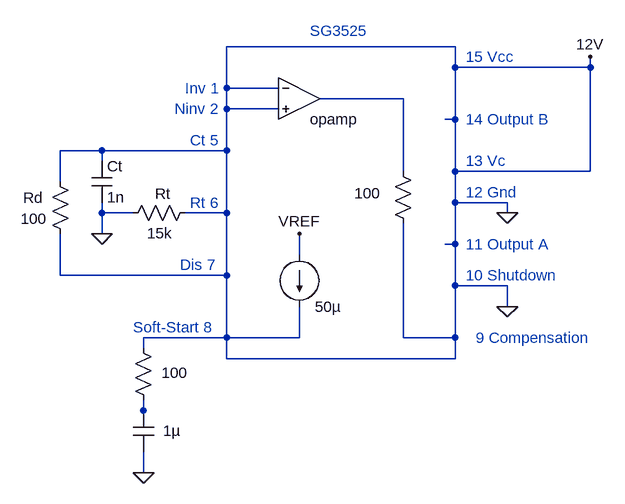
[diagram p0: schematic 00_basic_test_circuit.asc]
00_basic_test_circuit.asc, the LTspice schematic file:
Version 4
SHEET 1 2044 2052
WIRE 368 496 16 496
WIRE 368 528 368 496
WIRE 576 528 576 512
WIRE 576 528 368 528
WIRE 16 560 16 496
WIRE 96 560 16 560
WIRE 288 576 160 576
WIRE 16 592 16 560
WIRE 96 592 16 592
WIRE 368 608 368 528
WIRE 368 608 352 608
WIRE -176 656 -240 656
WIRE 16 656 16 592
WIRE 16 656 -176 656
WIRE -176 672 -176 656
WIRE 288 688 288 576
WIRE 368 688 368 608
WIRE 576 688 576 528
WIRE 576 688 368 688
WIRE -240 704 -240 656
WIRE 368 736 368 688
WIRE 448 736 368 736
WIRE -176 752 -176 736
WIRE -128 752 -176 752
WIRE 16 752 16 656
WIRE 16 752 -48 752
WIRE 448 752 448 736
WIRE -176 784 -176 752
WIRE 368 800 368 736
WIRE 368 800 352 800
WIRE 128 816 128 784
WIRE -240 848 -240 784
WIRE 16 848 16 752
WIRE 16 848 -240 848
WIRE 368 864 368 800
WIRE 448 864 368 864
WIRE 448 896 448 864
WIRE 16 944 16 848
WIRE 16 944 -112 944
WIRE 128 944 128 896
WIRE 128 944 16 944
WIRE 288 944 288 768
WIRE 368 944 368 864
WIRE 368 944 288 944
WIRE -112 960 -112 944
WIRE 16 976 16 944
WIRE 368 976 368 944
WIRE 368 976 16 976
WIRE -112 1056 -112 1040
WIRE -112 1072 -112 1056
WIRE -112 1152 -112 1120
FLAG 128 784 VREF
FLAG -176 784 0
FLAG 448 896 0
FLAG 448 752 0
FLAG 576 512 12V
FLAG -112 1152 0
SYMBOL current 128 816 R0
WINDOW 0 24 0 Invisible 2
SYMATTR InstName I1
SYMATTR Value 50µ
SYMBOL res 304 784 R180
WINDOW 0 36 76 Invisible 2
WINDOW 3 51 62 Left 2
SYMATTR InstName R1
SYMATTR Value 100
SYMBOL Opamps\\opamp 128 512 R0
WINDOW 0 0 32 Invisible 2
SYMATTR InstName U1
SYMBOL res -256 688 R0
WINDOW 0 -41 41 Left 2
WINDOW 3 -45 73 Left 2
SYMATTR InstName Rd
SYMATTR Value 100
SYMBOL res -32 736 R90
WINDOW 0 -29 50 VTop 2
WINDOW 3 32 55 VTop 2
SYMATTR InstName Rt
SYMATTR Value 15k
SYMBOL cap -192 672 R0
SYMATTR InstName Ct
SYMATTR Value 1n
SYMBOL res -128 944 R0
WINDOW 0 36 40 Invisible 2
WINDOW 3 44 54 Left 2
SYMATTR InstName R2
SYMATTR Value 100
SYMBOL cap -128 1056 R0
WINDOW 0 24 8 Invisible 2
WINDOW 3 46 31 Left 2
SYMATTR InstName C1
SYMATTR Value 1µ
TEXT -48 560 Left 2 ;Inv 1
TEXT -64 592 Left 2 ;Ninv 2
TEXT -40 640 Left 2 ;Ct 5
TEXT -40 736 Left 2 ;Rt 6
TEXT -56 832 Left 2 ;Dis 7
TEXT -128 928 Left 2 ;Soft-Start 8
TEXT 400 944 Left 2 ;9 Compensation
TEXT 384 848 Left 2 ;10 Shutdown
TEXT 384 800 Left 2 ;11 Output A
TEXT 384 608 Left 2 ;14 Output B
TEXT 384 720 Left 2 ;12 Gnd
TEXT 384 672 Left 2 ;13 Vc
TEXT 384 512 Left 2 ;15 Vcc
TEXT 144 472 Left 2 ;SG3525

The netlist it stands for:
* 00_basic_test_circuit.asc
I1 VREF 0 50µ
R1 0 N001 100
XU1 0 0 N001 opamp Aol=100K GBW=10Meg  ; pins invin noninvin out
Rd 0 0 100
Rt 0 0 15k
Ct 0 0 1n
R2 0 N002 100
C1 N002 0 1µ
* Inv 1
* Ninv 2
* Ct 5
* Rt 6
* Dis 7
* Soft-Start 8
* 9 Compensation
* 10 Shutdown
* 11 Output A
* 14 Output B
* 12 Gnd
* 13 Vc
* 15 Vcc
* SG3525
.backanno
.end